# Altium schematic sheet LSM6DSOX.SchDoc
size A4
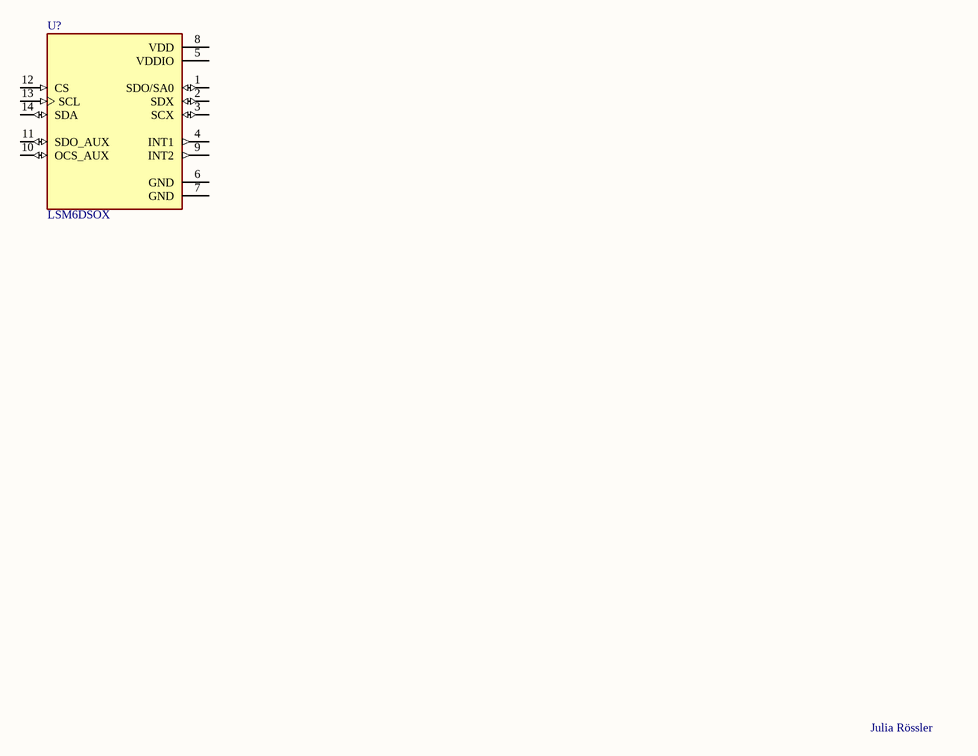
[diagram p0: LSM6DSOX.SchDoc]

## Parts
U?  LSM6DSOX  [PQFN50P250X300X86-14N]

## Nets

Not connected (* = marked no-connect by the designer): U? 1(SDO/SA0) 2(SDX) 3(SCX) 4(INT1) 5(VDDIO) 6(GND) 7(GND) 8(VDD) 9(INT2) 10(OCS_AUX) 11(SDO_AUX) 12(CS) 13(SCL) 14(SDA)

## Notes on the sheet
- Julia Rössler

## Library data of the parts
U? = LSM6DSOX: 3D Accelerometer and 3D Gyroscope Sensor Digital Output 1.8V 14-Pin LGA T/R; MF: STMicroelectronics; SnapEDA_Link: https://www.snapeda.com/parts/LSM6DSOX/STMicroelectronics/view-part/?ref=snap; Package: VFLGA-14 STMicroelectronics; Value: *; MP: LSM6DSOX; Check_prices: https://www.snapeda.com/parts/LSM6DSOX/STMicroelectronics/view-part/?ref=eda